# Altium schematic sheet DC_DC.SchDoc
size A4; SheetNumber: 1; SheetTotal: 1
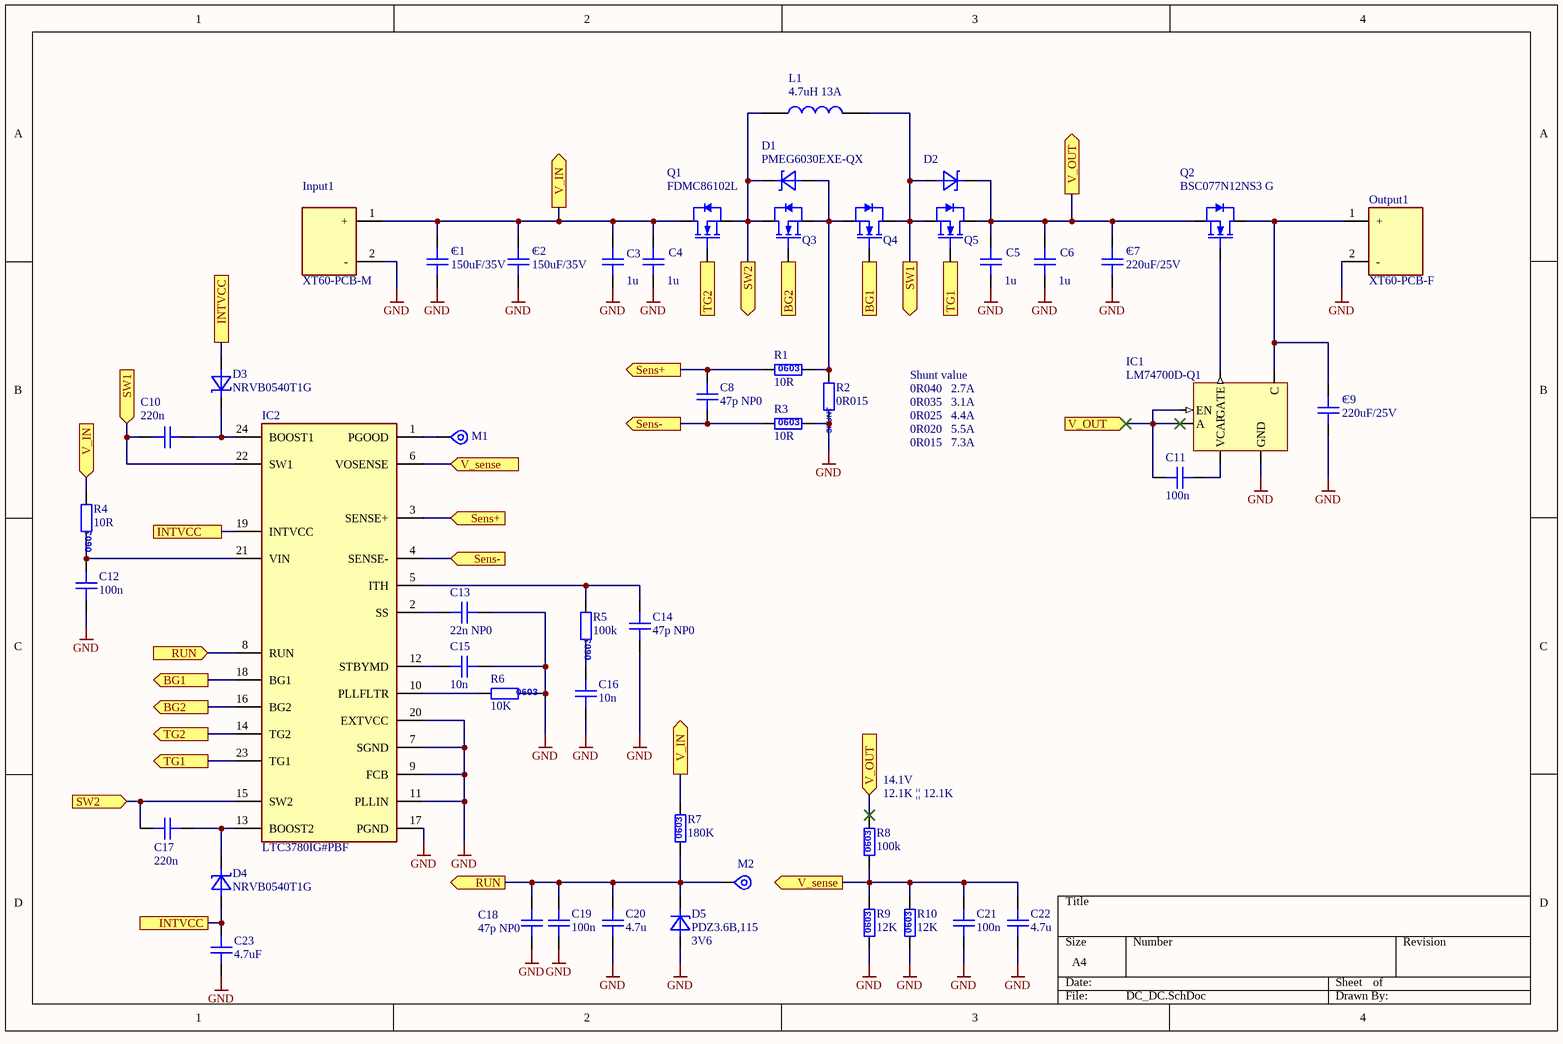
[diagram p0: DC_DC.SchDoc]

## Parts
C1  value 150uF/35V  [PZF8x9]  (hidden comment: 35PZE150M8X9)
C2  value 150uF/35V  [PZF8x9]  (hidden comment: 35PZE150M8X9)
C3  value 1u  [C1206_medium]  (hidden comment: C1206C105K5RACTU)
C4  value 1u  [C1206_medium]  (hidden comment: C1206C105K5RACTU)
C5  value 1u  [C1206_medium]  (hidden comment: C1206C105K5RACTU)
C6  value 1u  [C1206_medium]  (hidden comment: C1206C105K5RACTU)
C7  value 220uF/25V  [PZF8x9]  (hidden comment: 25PZF220M8X9)
C8  value 47p NP0  [C0603]  (hidden comment: GCM1885C2A470JA16J)
C9  value 220uF/25V  [PZF8x9]  (hidden comment: 25PZF220M8X9)
C10  value 220n  [C1206_thin]  (hidden comment: C1206C224J1RACAUTO)
C11  value 100n  [C0603]  (hidden comment: 06035C104K4Z2A)
C12  value 100n  [C1206_thin]  (hidden comment: GRT31C5C2A104JA12L)
C13  value 22n NP0  [C0603]  (hidden comment: AC0603KRX7R9BB223)
C14  value 47p NP0  [C0603]  (hidden comment: GCM1885C2A470JA16J)
C15  value 10n  [C0603]  (hidden comment: C0603X103K1RAC3316)
C16  value 10n  [C0603]  (hidden comment: C0603X103K1RAC3316)
C17  value 220n  [C1206_thin]  (hidden comment: C1206C224J1RACAUTO)
C18  value 47p NP0  [C0603]  (hidden comment: GCM1885C2A470JA16J)
C19  value 100n  [C0603]  (hidden comment: 06035C104K4Z2A)
C20  value 4.7u  [C0603]  (hidden comment: CL10B475KQ8NQNC)
C21  value 100n  [C0603]  (hidden comment: 06035C104K4Z2A)
C22  value 4.7u  [C0603]  (hidden comment: CL10B475KQ8NQNC)
C23  value 4.7uF  [C1206_thick]  (hidden comment: GRM31CC72A475ME11L)
D1  PMEG6030EXE-QX  [SOD123HP]
D2  PMEG6030EXE-QX  [SOD123HP]  (value not drawn)
D3  NRVB0540T1G  [SOD123HP]
D4  NRVB0540T1G  [SOD123HP]
D5  PDZ3.6B,115  value 3V6  [SOD323]
IC1  LM74700D-Q1  [SOIC127P600X175-8N]
IC2  LTC3780IG#PBF  [SOP65P780X200-24N]
Input1  XT60-PCB-M  [XT60-PCB-M]
L1  value 4.7uH 13A  [WE-HCI]  (hidden comment: 7443551470)
M1  TP  [Pad 1mm SMD]  (value not drawn)  (no BOM)
M2  TP  [Pad 1mm SMD]  (value not drawn)  (no BOM)
Output1  XT60-PCB-F  [XT60-PCB-F]
Q1  FDMC86102L  [PowerPak1212_LFPAK33]
Q2  BSC077N12NS3 G  [Power56_LFPAK]
Q3  FDMC86102L  [PowerPak1212_LFPAK33]  (value not drawn)
Q4  FDMC86102L  [PowerPak1212_LFPAK33]  (value not drawn)
Q5  FDMC86102L  [PowerPak1212_LFPAK33]  (value not drawn)
R1  value 10R  [R0603]  (hidden comment: CR0603-FX-10R0ELF)
R2  value 0R015  [Shunt_2512]  (hidden comment: GMR100HTBFER015)
R3  value 10R  [R0603]  (hidden comment: CR0603-FX-10R0ELF)
R4  value 10R  [R0603]  (hidden comment: CR0603-FX-10R0ELF)
R5  value 100k  [R0603]  (hidden comment: RC0603FR-07100KL)
R6  value 10K  [R0603]  (hidden comment: CRGP0603F10K)
R7  value 180K  [R0603]  (hidden comment: CRGCQ0603F180K)
R8  value 100k  [R0603]  (hidden comment: RC0603FR-07100KL)
R9  value 12K  [R0603]  (hidden comment: CRGCQ0603F12K)
R10  value 12K  [R0603]  (hidden comment: CRGCQ0603F12K)

## Ports
BG1 (in, see DC_DC[1C]), BG1 (out, see DC_DC[3B]), BG2 (in, see DC_DC[1C]), BG2 (out, see DC_DC[3B]), INTVCC (see DC_DC[1B], DC_DC[1C]), INTVCC (see DC_DC[1B], DC_DC[1D]), INTVCC (see DC_DC[1C], DC_DC[1D]), RUN (in, see DC_DC[2D]), RUN (out, see DC_DC[1C]), Sens+ (in, see DC_DC[2B]), Sens+ (out, see DC_DC[2C]), Sens- (in, see DC_DC[2B]), Sens- (out, see DC_DC[2C]), SW1 (in, see DC_DC[3B]), SW1 (out, see DC_DC[1B]), SW2 (in, see DC_DC[2B]), SW2 (out, see DC_DC[1D]), TG1 (in, see DC_DC[1C]), TG1 (out, see DC_DC[3B]), TG2 (in, see DC_DC[1C]), TG2 (out, see DC_DC[2B]), V_IN (in, see DC_DC[2A], DC_DC[2D]), V_IN (out, see DC_DC[1B], DC_DC[2A]), V_IN (out, see DC_DC[1B], DC_DC[2D]), V_OUT (in, see DC_DC[3A], DC_DC[3B]), V_OUT (in, see DC_DC[3A], DC_DC[3D]), V_OUT (out, see DC_DC[3B], DC_DC[3D]), V_sense (in, see DC_DC[2D]), V_sense (out, see DC_DC[2B])

## Nets
GND: C1.2 C2.2 C3.1 C4.1 C5.1 C6.1 C7.2 C9.2 C12.2 C13.1 C14.1 C15.2 C16.1 C18.1 C19.1 C20.2 C21.1 C22.2 C23.2 D5.1(A) IC1.1(GND) IC2.7(SGND) IC2.9(FCB) IC2.11(PLLIN) IC2.17(PGND) IC2.20(EXTVCC) Input1.2(-) Output1.2(-) R2.1 R3.1 R6.2 R9.2 R10.2
BG1: IC2.18(BG1) Q4.4(GATE) ; port BG1
BG2: IC2.16(BG2) Q3.4(GATE) ; port BG2
INTVCC: C23.1 D3.1(A) D4.1(A) IC2.19(INTVCC) ; port INTVCC
RUN: C18.2 C19.2 C20.1 D5.2(C) IC2.8(RUN) M2.1 R7.2 ; port RUN
Sens+: C8.2 IC2.3(SENSE+) R1.2 ; port Sens+
Sens-: C8.1 IC2.4(SENSE-) R3.2 ; port Sens-
SW1: C10.2 D2.1(A) IC2.22(SW1) L1.1 Q4.5(DRAIN) Q5.1,_2,_3(SOURCE) ; port SW1
SW2: C17.2 D1.2(C) IC2.15(SW2) L1.2 Q1.1,_2,_3(SOURCE) Q3.5(DRAIN) ; port SW2
TG1: IC2.23(TG1) Q5.4(GATE) ; port TG1
TG2: IC2.14(TG2) Q1.4(GATE) ; port TG2
V_IN: C1.1 C2.1 C3.2 C4.2 Input1.1(+) Q1.5(DRAIN) R4.1 R7.1 ; port V_IN
V_OUT: C5.2 C6.2 C7.1 C11.2 D2.2(C) IC1.2(EN) IC1.5(A) Q2.1,_2,_3(SOURCE) Q5.5(DRAIN) R8.1 ; port V_OUT
V_sense: C21.2 C22.1 IC2.6(VOSENSE) R8.2 R9.1 R10.1 ; port V_sense
NetC9_1: C9.1 IC1.8(C) Output1.1(+) Q2.5(DRAIN)
NetC10_1: C10.1 D3.2(C) IC2.24(BOOST1)
NetC11_1: C11.1 IC1.4(VCAP)
NetC12_1: C12.1 IC2.21(VIN) R4.2
NetC13_2: C13.2 IC2.2(SS)
NetC14_2: C14.2 IC2.5(ITH) R5.1
NetC15_1: C15.1 IC2.12(STBYMD)
NetC16_2: C16.2 R5.2
NetC17_1: C17.1 D4.2(C) IC2.13(BOOST2)
NetD1_1: D1.1(A) Q3.1,_2,_3(SOURCE) Q4.1,_2,_3(SOURCE) R1.1 R2.2
NetIC1_6: IC1.6(GATE) Q2.4(GATE)
NetIC2_1: IC2.1(PGOOD) M1.1
NetIC2_10: IC2.10(PLLFLTR) R6.1

## Notes on the sheet
- Shunt value
- 0R040   2.7A
- 0R035   3.1A
- 0R025   4.4A
- 0R020   5.5A
- 0R015   7.3A
- (near R8) 14.1V
- (near R8) 12.1K || 12.1K
- (in symbol 25PZF220M8X9) +
- (in symbol 35PZE150M8X9) +
- (in symbol CR_0603_100) 0603
- (in symbol CR_0603_103) 0603
- (in symbol CR_0603_104) 0603
- (in symbol CR_0603_123) 0603
- (in symbol CR_0603_184) 0603
- (in symbol SHUNT_2512_0R015) SHUNT

## Library data of the parts
C1 C2 = 35PZE150M8X9: High temp hybrid capacitor -55/125C / 150uF/35V; SMD/THD: THT; Main: Capacitors; Supplier 1: Mouser; Supplier 2: Digi-Key; Supplier Part Number 2: 35PZE150M8X9-ND; Supplier Part Number 1: 232-35PZE150M8X9; Category: Capacitors THT; Status: A; Component Type: Capacitors
C3-C6 = CC_1206_X7R_105: Ceramic Capacitor X7R 50V; Supplier 1: Mouser; Supplier 2: Digi-Key; Supplier 3: Farnell; Supplier Part Number 2: 490-5810-1-ND; Supplier Part Number 1: 81-GCJ31MR71H105KA2L; Supplier Part Number 3: 2781416
C7 C9 = 25PZF220M8X9: High temp hybrid capacitor -55/125C / 220uF/25V; SMD/THD: THT; Main: Capacitors; Supplier 1: Mouser; Supplier 2: Digi-Key; Supplier Part Number 2: 25PZF220M8X9-ND; Supplier Part Number 1: 232-25PZF220M8X9; Category: Capacitors THT; Status: A; Component Type: Capacitors
C8 C14 C18 = CC_0603_NP0_470: Ceramic Capacitor NP0 100V; SMD/THD: SMD; Main: Capacitors; Category: Capacitors CERA SMD; Status: A; ComponentLink1Description: datasheet; Component Type: Capacitors; Supplier 1: Mouser; Supplier Part Number 1: 81-GCM1885C2A470JA6J; Supplier 2: Farnell; Supplier Part Number 2: 3784365
C10 C17 = CC_1206_X7R_224: Ceramic Capacitor X7R 100V; Supplier 1: Mouser; Supplier 2: Digi-Key; Supplier Part Number 2: 399-C1206C224J1RACAUTOCT-ND; Supplier Part Number 1: 80-C1206C224J1RAUTO
C11 C19 C21 = CC_0603_X7R_104: Ceramic Capacitor X7R 50V; Part Number: 100n/50V X7R C0603; SMD/THD: SMD; Main: Capacitors; Supplier 1: Mouser; Supplier 2: Farnell; Supplier Part Number 1: 581-06035C104K4Z2A; Supplier Part Number 2: 1833843; Category: Capacitors CERA SMD; Status: A; Component Type: Capacitors; Manufacturer Part Number: 100n/50V X7R C0603
C12 = CC_1206_NP0_104: Ceramic Capacitor NP0 100V; Supplier 1: Mouser; Supplier 2: Digi-Key; Supplier Part Number 1: 81-GRT31C5C2A104JA2L; Supplier Part Number 2: 490-GRT31C5C2A104JA12LDKR-ND
C13 = CC_0603_X7R_223: Ceramic Capacitor NP0 50V; Part Number: 22n/50V X7R C0603; Main: Capacitors; SMD/THD: SMD; Category: Capacitors CERA SMD; Status: A; Manufacturer Part Number: 22n/50V X7R C0603; Component Type: Capacitors; Supplier 1: Mouser; Supplier 2: Farnell; Supplier 3: Digi-Key; Supplier Part Number 3: 311-3119-6-ND; Supplier Part Number 2: 3368998; Supplier Part Number 1: 603-AC603KRX7R9BB223
C15 C16 = CC_0603_X7R_103: Ceramic Capacitor X7R 100V; Part Number: 10n/100V X7R C0603; SMD/THD: SMD; Main: Capacitors; Status: A; Category: Capacitors CERA SMD; Component Type: Capacitors; Supplier 1: Mouser; Supplier 2: Digi-Key; Supplier 3: Farnell; Supplier 4: TME; Supplier Part Number 1: 80-C0603X103K1R3316; Supplier Part Number 2: 399-C0603X103K1RAC3316CT-ND; Supplier Part Number 3: 2666889; Supplier Part Number 4: C0603X103K1RAC3316
C20 C22 = CC_0603_X7R_475: Ceramic Capacitor X7R 6.3V; SMD/THD: SMD; Main: Capacitors; Supplier 1: Mouser; Supplier Part Number 1: 187-CL10B475KQ8NQNC; Category: Capacitors CERA SMD; Status: A; ComponentLink1Description: datasheet; Component Type: Capacitors
C23 = CC_1206_X7S_475: Ceramic Capacitor X7S 100V; Supplier 1: Mouser; Supplier 2: Digi-Key; Supplier Part Number 1: 81-GRM31CC72A475ME11; Supplier Part Number 2: 490-18621-6-ND
D1 D2 = PMEG6030EXE-QX: Schottky Diode 60V, 3A; SMD/THD: SMD; Main: Diodes; Category: Schottky; Status: A; Supplier 1: Digikey; Supplier Part Number 1: 1727-PMEG6030EXE-QXCT-ND; Supplier 2: Mouser; Supplier Part Number 2: 771-PMEG6030EXE-Q; Value: PMEG6030EXE
D3 D4 = NRVB0540T1G: Schottky Diode 40V, 500mA; SMD/THD: SMD; Main: Diodes; Value: NRVB0540T1G; Category: Schottky; Status: A; Supplier 1: Mouser; Supplier Part Number 1: 863-NRVB0540T1G; Supplier 2: Farnell; Supplier Part Number 2: 2723913
D5 = PDZ3.6B,115: Zener Diode 3.6V, 400mW; SMD/THD: SMD; Main: Diodes; Category: Zener; Status: A; Supplier 1: Mouser; Supplier Part Number 1: 771-PDZ36B8115; Supplier 2: TME; Supplier Part Number 2: PDZ3.6B.115
IC1 = LM74700D-Q1: Reverse Battery Protection Ideal Diode Controller
IC2 = LTC3780IG#PBF: DC/DC Buck-Boost; Manufacturer_Name: Analog Devices; Height: 2mm; Manufacturer_Part_Number: LTC3780IG#PBF; Supplier 1: Mouser; Supplier 2: TME; Supplier Part Number 2: LTC3780IGPBF; Supplier Part Number 1: 584-LTC3780IG#PBF
Input1 = XT60-PCB-M: XT60 Connector; Manufacturer_Name: Amass; Manufacturer_Part_Number: XT30PB; Datasheet Link: https://www.tme.eu/Document/4acc913878197f8c2e30d4b8cdc47230/XT30UPB%20SPEC.pdf; Height: 10.7mm
L1 = WE-HCI High Current 4.7uH-13A: WE-HCI SMT High Current Inductor 4.7uH 20% 100kHz Ferrite 13A SMD T/R / Frequency - Self Resonant 30MHz; Supplier 1: Digikey; Supplier Part Number 1: 732-7443551470CT-ND; Supplier 2: Mouser; Supplier Part Number 2: 710-7443551470
M1 M2 = TP_PCB: Test Point; Main: Mechanical; Category: Pads_Pins_Measure_Points; Stock number: --------; Component Type: Mechanical
Output1 = XT60-PCB-F: XT60 Connector; Manufacturer_Name: Amass; Manufacturer_Part_Number: XT30PB; Datasheet Link: https://www.tme.eu/Document/4acc913878197f8c2e30d4b8cdc47230/XT30UPB%20SPEC.pdf; Height: 10.7mm
Q1 Q3-Q5 = FDMC86102L: Single N-Channel 100V, 18A, 23mOhm; Manufacturer: ON Semiconductor / Fairchild; Main: Transistors; SMD/THD: SMD; Category: N-MOS; Value: FDMC86102L; ComponentLink1Description: Datasheet; ComponentLink1URL: http://www.farnell.com/datasheets/1837750.pdf; Status: A; Part Number: FDMC86102L; Manufacturer Part Number: FDMC86102L; Component Type: Transistors; Supplier 1: Mouser; Supplier Part Number 1: 512-FDMC86102L; Supplier 2: Digi-Key; Supplier Part Number 2: FDMC86102LFSCT-ND
Q2 = BSC077N12NS3 G: Single N-Channel 120V, 98A, 7.7mOhm; Manufacturer: Infineon; Main: Transistors; SMD/THD: SMD; Category: N-MOS; Value: BSC077N12NS3 G; ComponentLink1Description: Datasheet; ComponentLink1URL: http://datasheet.octopart.com/BSC077N12NS3-G-Infineon-datasheet-62293626.pdf; Status: A; Part Number: BSC077N12NS3 G; Manufacturer Part Number: BSC077N12NS3G; Component Type: Transistors; Supplier 1: Mouser; Supplier Part Number 1: 726-BSC077N12NS3GATM; Supplier 2: Digi-Key; Supplier Part Number 2: BSC077N12NS3GATMA1CT-ND
R1 R3 R4 = CR_0603_100: Resistor 1%, 0.1W, 75V; SMD/THD: SMD; Main: Resistors; Status: A; Category: Resistors SMD; Component Type: Resistors; Supplier 1: Mouser; Supplier 2: Farnell; Supplier 3: Digi-Key; Supplier Part Number 2: 2321756; Supplier Part Number 1: 652-CR0603FX-10R0ELF; Supplier Part Number 3: CR0603-FX-10R0ELFDKR-ND
R2 = SHUNT_2512_0R015: Current Sense Resistor 1%, 3W, AEC-Q200; SMD/THD: SMD; Main: Resistors; Status: A; Category: Resistors SMD; Component Type: Resistors; Supplier 1: Mouser; Supplier Part Number 1: 755-GMR100HTBFER015; Supplier 2: Digi-Key; Supplier Part Number 2: 511-1687-1-ND; Supplier 3: Farnell; Supplier Part Number 3: 2808331
R5 = CR_0603_104: Resistor 1%, 0.1W, 75V; SMD/THD: SMD; Main: Resistors; Status: A; Category: Resistors SMD; Component Type: Resistors; Supplier 1: Mouser; Supplier 2: Farnell; Supplier 3: TME; Supplier Part Number 2: 9238727; Supplier Part Number 1: 603-RC0603FR-07100KL; Supplier Part Number 3: RC0603FR-07100K
R6 = CR_0603_103: Resistor 1%, 0.1W, 75V; SMD/THD: SMD; Main: Resistors; Status: A; Category: Resistors SMD; Component Type: Resistors; Supplier 1: Mouser; Supplier 2: Digi-Key; Supplier 3: Farnell; Supplier Part Number 3: 2861046; Supplier Part Number 2: A130428CT-ND; Supplier Part Number 1: 279-CRGP0603F10K
R7 = CR_0603_184: Resistor 1%, 0.1W, 75V; SMD/THD: SMD; Main: Resistors; Status: A; Category: Resistors SMD; Component Type: Resistors; Supplier 1: Mouser; Supplier Part Number 1: 279-CRGCQ0603F180K; Supplier 2: Digi-Key; Supplier Part Number 2: A129715CT-ND; Supplier 3: Farnell; Supplier Part Number 3: 2861488
R8 = CR_0603_104: Resistor 1%, 0.1W, 75V; Main: Resistors; SMD/THD: SMD; Category: Resistors SMD; Status: A; Component Type: Resistors; Supplier 1: Mouser; Supplier 2: Farnell; Supplier 3: TME; Supplier Part Number 1: 603-RC0603FR-07100KL; Supplier Part Number 2: 9238727; Supplier Part Number 3: RC0603FR-07100K
R9 R10 = CR_0603_123: Resistor 1%, 0.1W, 75V; Main: Resistors; SMD/THD: SMD; Category: Resistors SMD; Status: A; Component Type: Resistors; Supplier 1: Mouser; Supplier 2: Digi-Key; Supplier 3: Farnell; Supplier Part Number 1: 279-CRGCQ0603F12K; Supplier Part Number 2: A129701CT-ND; Supplier Part Number 3: 2861474